# EAGLE design NanoDapAdapter (EAGLE 9.6.2)
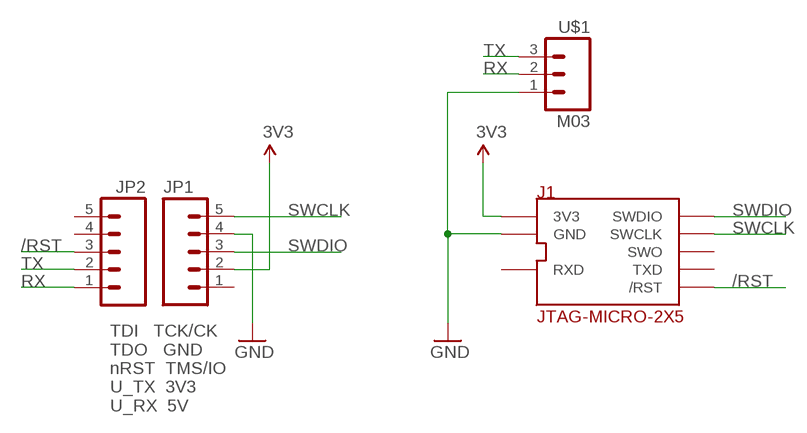
[diagram p0: schematic, sheet 1]

## Parts
J1  JTAG-MICRO-2X5  [JTAG-MICRO-2X5]
JP1  M05PTH  [1X05]
JP2  M05PTH  [1X05]
U$1  M03  [1X03]

## Nets
3V3: J1.1(3V3) JP1.2
/RST: J1.10(/RST) JP2.3
GND: J1.3(GND) J1.5(GND) J1.9(GND) JP1.4 U$1.1
RX: JP2.1 U$1.2
SWCLK: J1.4(SWCLK) JP1.5
SWDIO: J1.2(SWDIO) JP1.3
TX: JP2.2 U$1.3
Unconnected: J1.6(SWO) J1.7(RXD) J1.8(TXD) JP1.1 JP2.4 JP2.5

## Notes on the sheet
- TDI   TCK/CK
  TDO   GND
  nRST  TMS/IO
  U_TX  3V3
  U_RX  5V

## Library data of the parts
J1 = rickk2:JTAG-MICRO-2X5: JTAG Connector $2.90 CONN HEADER SMD 10POS 1.27MM Connector Header Surface Mount 10 position 0.050" (1.27mm) Samtec FTSH-105-01-F-DV-K https://www.digikey.com/product-detail/en/FTSH-105-01-F-DV-K/SAM8796-ND/2649974?utm_campaign=buynow&WT.z_cid=ref_octopart_dkc_buynow&utm_medium=aggregator&curr=usd&site=us&utm_source=octopart
JP1 JP2 = rickk2:M05: Header 5 Standard 5-pin 0.1" header. Use with straight break away headers (SKU : PRT-00116), right angle break away headers (PRT-00553), swiss pins (PRT-00743), machine pins (PRT-00117), and female headers (PRT-00115). Molex polarized connector foot print use with SKU : PRT-08230 with associated crimp pins and housings.
U$1 = rickk2:M03: Breakaway 0.1" header x3

## Board
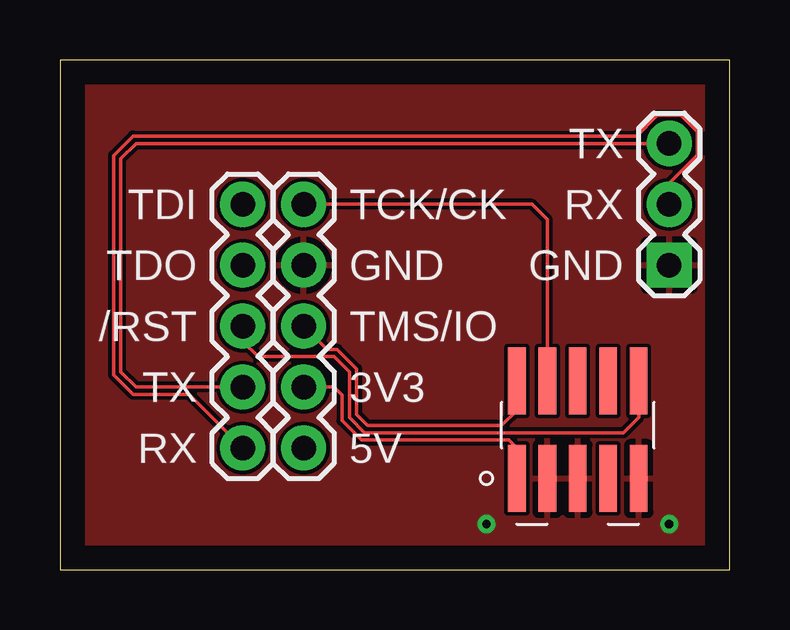
[diagram p1: board, top side]
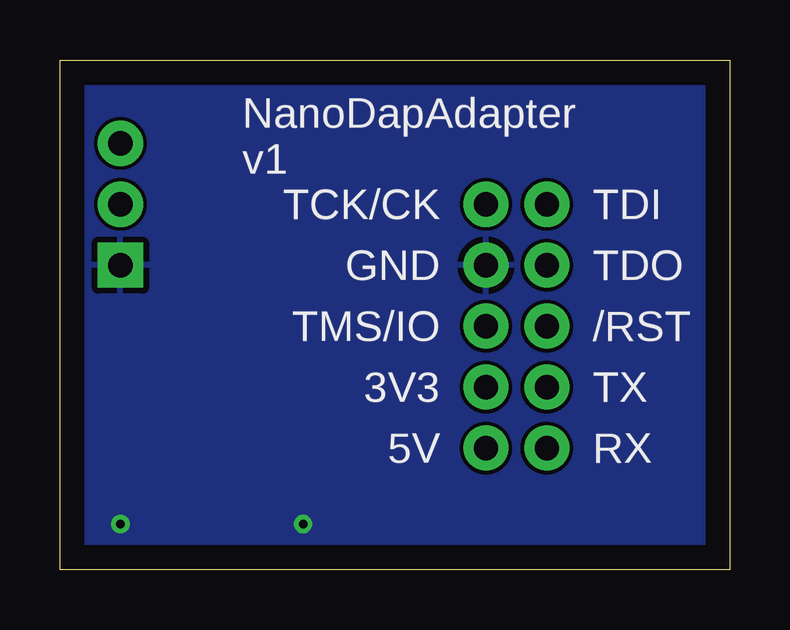
[diagram p2: board, bottom side, seen from below]

Size 27.92 x 21.26 mm. Coordinates in mm from the lower left corner, seen from the top.
Outline: 0,0 27.92,0 27.92,21.26 0,21.26 0,0
Copper layers (1*16): Top 0.035mm / dielectric 1.5mm / Bottom 0.035mm
Design rules "default": minimum track width 6mil, minimum drill 0.35mm, track to track 6mil, track to pad 6mil, pad to pad 6mil, via to via 6mil, smd to smd 6mil, copper to edge 40mil, drill to drill 6mil, minimum pad ring 10mil, minimum via ring 8mil, stop-mask expansion 4mil, vias tented up to drill 0mil, thermal gap 10mil

### Footprints (pad centres in the part's own frame; a part is rotated, then mirrored left to right if it is on the bottom)
JTAG-MICRO-2X5 = smd 0.737 x 2.794: 1 0,0; 2 0,4.064; 3 1.27,0; 4 1.27,4.064; 5 2.54,0; 6 2.54,4.064; 7 3.81,0; 8 3.81,4.064; 9 5.08,0; 10 5.08,4.064
1X05 = drill 1.016 pad 1.88: 1 0,0; 2 2.54,0; 3 5.08,0; 4 7.62,0; 5 10.16,0
1X03 = drill 1.016 pad 1.88 square: 1 0,0 | drill 1.016 pad 1.88: 2 2.54,0; 3 5.08,0

### Placement (x,y rotation side)
J1  19.05,3.81 0 top
JP1  10.16,5.08 90 top
JP2  7.62,5.08 90 top
U$1  25.4,12.7 90 top

### Tracks (layer width: path | path; a pad name or v marks a point on that pad's centre or on a via)
3V3
  Top 0.152: JP1.2 11.43,7.62 11.76,7.29 11.76,6.22 12.57,5.41 18.72,5.41 19.05,5.08 J1.1
/RST
  Top 0.152: J1.10 24.13,6.35 23.5,5.71 12.7,5.71 12.06,6.35 12.06,8.26 11.43,8.89 8.26,8.89 7.62,9.53 JP2.3
GND  (via drill 0.35)
  other vias: 17.78,1.91 25.4,1.91
  pour Top: 0,0 0,22.86 29.21,22.86 29.21,0
  pour Bottom: 0,0 0,24.13 30.48,24.13 30.48,0
RX
  Top 0.152: JP2.1 5.38,7.32 3.05,7.32 2.23,8.13 2.23,17.27 3.05,18.09 24.05,18.09 24.92,18.95 25.88,18.95 26.57,18.26 26.57,17.3 25.4,16.13 U$1.2
SWCLK
  Top 0.152: J1.4 20.32,14.61 19.68,15.24 JP1.5
SWDIO
  Top 0.152: J1.2 19.05,6.66 18.41,6.02 12.83,6.02 12.37,6.48 12.37,8.38 11.56,9.2 11.43,9.2 11.12,9.2 JP1.3
TX
  Top 0.152: JP2.2 3.17,7.62 2.54,8.26 2.54,17.14 3.17,17.78 U$1.3

### Text on the board
tPlace: TX | TDI | RX | TCK/CK | TDO | GND | GND | /RST | TMS/IO | TX | 3V3 | RX | 5V
bPlace: NanoDapAdapter / v1 | TCK/CK | TDI | GND | TDO | TMS/IO | /RST | 3V3 | TX | 5V | RX